# Altium project DOME.PrjPcb
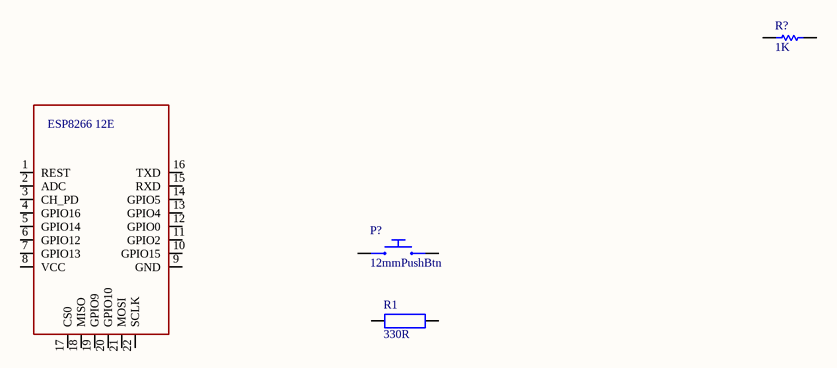
[diagram p0: DOME_Sch.SchDoc]
1 sheet, 4 parts. Net scope: global (net labels, ports and power ports of the same name join across sheets).
Board file: DOME_Pcb.PcbDoc

## Sheet DOME_Sch.SchDoc
size A4; SheetNumber: 1; SheetTotal: 1

### Parts
?  ESP8266 12E  [ESP8266 12E]
P?  12mmPushBtn  [12mmPushBtn]
R1  330R  [330R_P8mm_0.25w]
R?  value 1K  (hidden comment: Resistor)

### Nets

Not connected (* = marked no-connect by the designer): ? 1(REST) 2(ADC) 3(CH_PD) 4(GPIO16) 5(GPIO14) 6(GPIO12) 7(GPIO13) 8(VCC) 9(GND) 10(GPIO15) 11(GPIO2) 12(GPIO0) 13(GPIO4) 14(GPIO5) 15(RXD) 16(TXD) 17(CS0) 18(MISO) 19(GPIO9) 20(GPIO10) 21(MOSI) 22(SCLK); P? 1 2(36); R1 1 2; R? 1 2

### Library data of the parts
R? = Resistor: TC1: 0; SimulationGenericComponent: True; TC2: 0